# EAGLE design Shunt_Board_V1.0 (EAGLE 9.6.2)
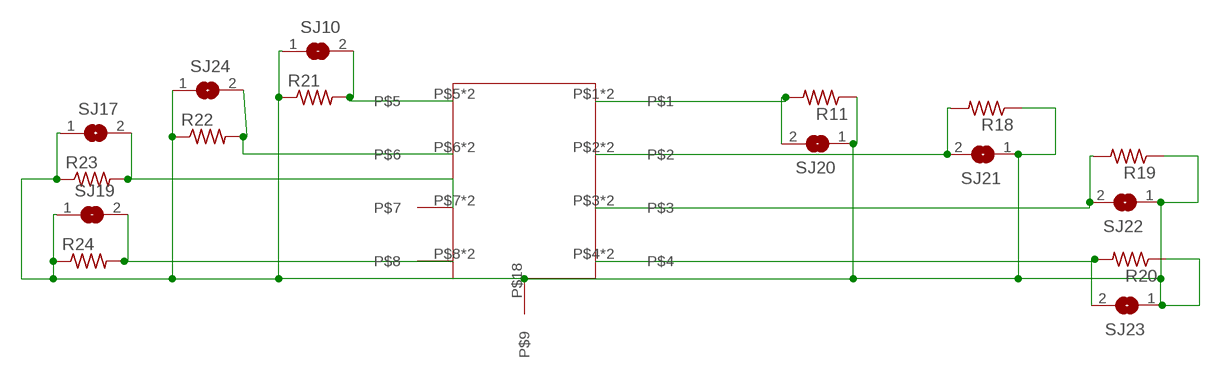
[diagram p0: schematic, sheet 1]

## Parts
R11  R-US_0204/5  [0204/5]
R18  R-US_0204/5  [0204/5]
R19  R-US_0204/5  [0204/5]
R20  R-US_0204/5  [0204/5]
R21  R-US_0204/5  [0204/5]
R22  R-US_0204/5  [0204/5]
R23  R-US_0204/5  [0204/5]
R24  R-US_0204/5  [0204/5]
SJ10  SJ  [SJ]
SJ17  SJ  [SJ]
SJ19  SJ  [SJ]
SJ20  SJ  [SJ]
SJ21  SJ  [SJ]
SJ22  SJ  [SJ]
SJ23  SJ  [SJ]
SJ24  SJ  [SJ]
U$28  SHUNT2  [SHUNT2]

## Nets
N$91: R18.2 SJ21.2 U$28.P$2 U$28.P$11
N$92: R19.2 SJ22.2 U$28.P$3 U$28.P$12
N$93: R20.2 SJ23.2 U$28.P$4 U$28.P$13
N$94: R21.2 SJ10.2 U$28.P$5 U$28.P$14
N$95: R22.2 SJ24.2 U$28.P$6 U$28.P$15
N$96: R23.2 SJ17.2 U$28.P$7 U$28.P$16
N$97: R24.2 SJ19.2 U$28.P$8 U$28.P$17
N$98: R11.1 R18.1 R19.1 R20.1 R21.1 R22.1 R23.1 R24.1 SJ10.1 SJ17.1 SJ19.1 SJ20.1 SJ21.1 SJ22.1 SJ23.1 SJ24.1 U$28.P$18
N$99: R11.2 SJ20.2 U$28.P$1 U$28.P$10

## Library data of the parts
R11 R18-R24 = rcl:R-US_: RESISTOR, American symbol; SPICEPREFIX: R
SJ10 SJ17 SJ19-SJ24 = jumper:SJ: SMD solder JUMPER
U$28 = Shunt2:SHUNT2

## Net classes
0 default: width 0.15 mm
1 +5V: width 0.305 mm
2 GND: width 0.305 mm
3 +3.3V: width 0.305 mm
4 SCL: width 0.15 mm
5 SDA: width 0.15 mm

## Board
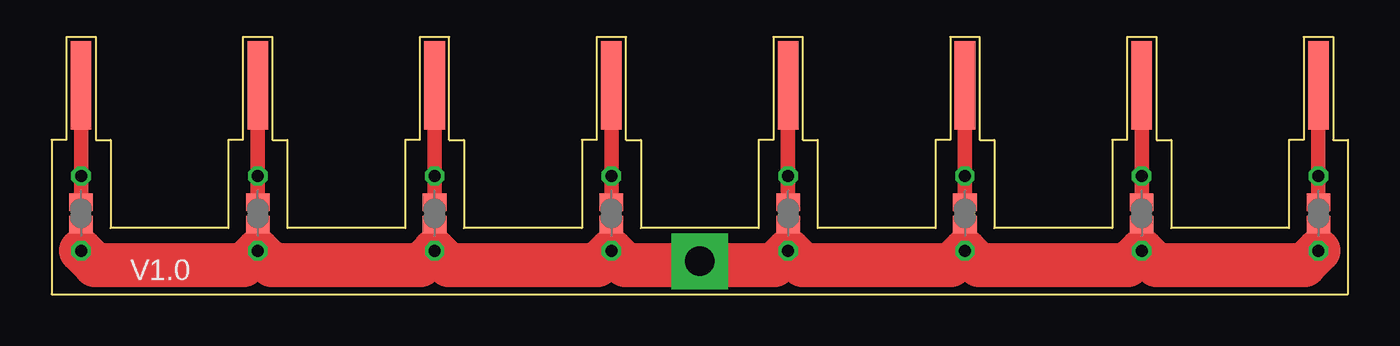
[diagram p1: board, top side]
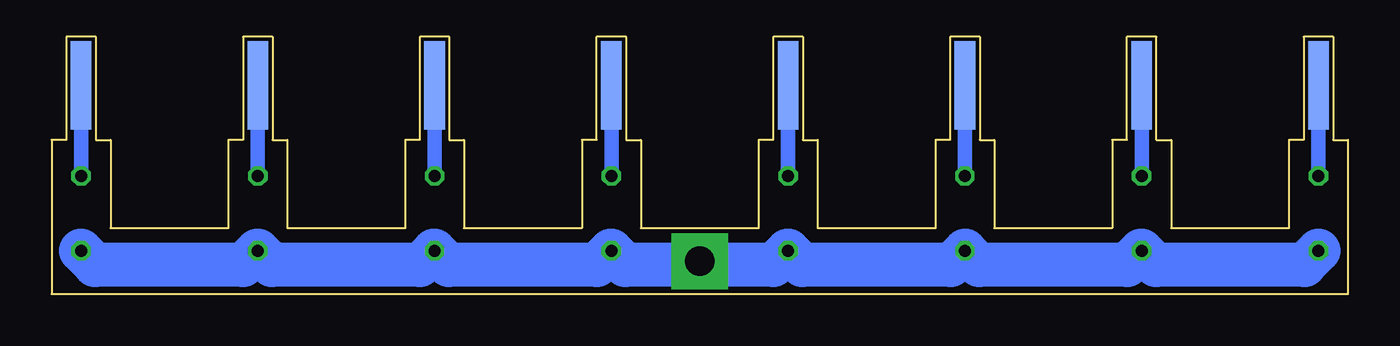
[diagram p2: board, bottom side, seen from below]

Size 88 x 17.5 mm. Coordinates in mm from the lower left corner, seen from the top.
Copper layers (1*16): Top 0.035mm / dielectric 1.5mm / Bottom 0.035mm
Design rules "default *": minimum track width 6mil, minimum drill 0.35mm, track to track 0.25mm, track to pad 0.25mm, pad to pad 6mil, via to via 6mil, smd to smd 6mil, copper to edge 0.2mm, drill to drill 6mil, minimum pad ring 10mil, minimum via ring 8mil, stop-mask expansion 4mil, vias tented up to drill 0mil, thermal gap 10mil

### Footprints (pad centres in the part's own frame; a part is rotated, then mirrored left to right if it is on the bottom)
0204/5 = drill 0.813 octagon: 1 -2.54,0; 2 2.54,0
SJ = smd 1.168 x 1.6: 1 -0.762,0; 2 0.762,0
SHUNT2 = smd 1.4 x 6: P$1 -85,-3.3; P$2 -73,-3.3; P$3 -61,-3.3; P$4 -49,-3.3; P$5 -37,-3.3; P$6 -25,-3.3; P$7 -13,-3.3; P$8 -1,-3.3 | smd 1.4 x 6 bottom: P$10 -85,-3.3; P$11 -73,-3.3; P$12 -61,-3.3; P$13 -49,-3.3; P$14 -37,-3.3; P$15 -25,-3.3; P$16 -13,-3.3; P$17 -1,-3.3 | drill 2 pad 3.81 square: P$18 -43,-15.25

### Placement (x,y rotation side)
R11  2,5.5 90 top
R18  14,5.5 90 top
R19  26,5.5 90 top
R20  38,5.5 90 top
R21  50,5.5 90 top
R22  62,5.5 90 top
R23  74,5.5 90 top
R24  86,5.5 90 top
SJ10  50,5.5 90 top
SJ17  74,5.5 90 top
SJ19  86,5.5 90 top
SJ20  2,5.5 90 top
SJ21  14,5.5 90 top
SJ22  26,5.5 90 top
SJ23  38,5.5 90 top
SJ24  62,5.5 90 top
U$28  87,17.5 0 top

### Tracks (layer width: path | path; a pad name or v marks a point on that pad's centre or on a via)
N$91
  Top 1: U$28.P$11 R18.2 SJ21.2
  Bottom 1: U$28.P$11 R18.2
N$92
  Top 1: U$28.P$3 R19.2 SJ22.2
  Bottom 1: U$28.P$3 R19.2
N$93
  Top 1: U$28.P$4 R20.2 SJ23.2
  Bottom 1: U$28.P$4 R20.2
N$94
  Top 1: U$28.P$14 R21.2 SJ10.2
  Bottom 1: U$28.P$14 R21.2
N$95
  Top 1: SJ24.2 R22.2 U$28.P$6
  Bottom 1: U$28.P$6 R22.2
N$96
  Top 1: U$28.P$16 R23.2 SJ17.2
  Bottom 1: U$28.P$16 R23.2
N$97
  Top 1: SJ19.2 R24.2 U$28.P$17
  Bottom 1: U$28.P$17 R24.2
N$98
  Top 1: SJ20.1 R11.1 | SJ21.1 R18.1 | SJ22.1 R19.1 | R20.1 SJ23.1 | R21.1 SJ10.1 | R22.1 SJ24.1 | SJ17.1 R23.1 | SJ19.1 R24.1
  Top 3: R11.1 2.96,2 13.04,2 R18.1 14.96,2 25.04,2 R19.1 26.96,2 37.04,2 R20.1 | R21.1 50.04,2.96 51,2 61.04,2 R22.1 62.96,2 73.04,2 R23.1 74.04,2.96 75,2 85.04,2 R24.1 | 38.86,2.1 R20.1 | 49.14,2.1 R21.1 | R21.1 49.04,2 44.24,2 U$28.P$18 43.74,2 38.96,2 R20.1
  Bottom 3: R11.1 2.96,2 13.04,2 R18.1 14.04,2.96 15,2 25.04,2 R19.1 26.96,2 37.04,2 R20.1 38.04,2.96 39,2 44.2,2 U$28.P$18 44.25,2 49.04,2 R21.1 50.04,2.96 51,2 61.04,2 R22.1 62.04,2.96 63,2 73.04,2 R23.1 74.04,2.96 75,2 85.04,2 R24.1
N$99
  Top 1: U$28.P$10 R11.2 SJ20.2
  Bottom 1: U$28.P$10 R11.2

### Text on the board
tPlace: V1.0